# EasyEDA Pro project 2轴4.0控制板PCB源文件（LY-2X4.5-V4-ESD）.eprj, schematic 2轴4.0-
Board Name: 2轴4.0-; Create Date: 2025-01-15; Page Name: 2轴4.0-; Project Name: 2轴4.0; Schematic Name: 2轴4.0-; Update Date: 2025-01-18; Company: 嘉立创EDA; Page Size: A2; Version: V1.0
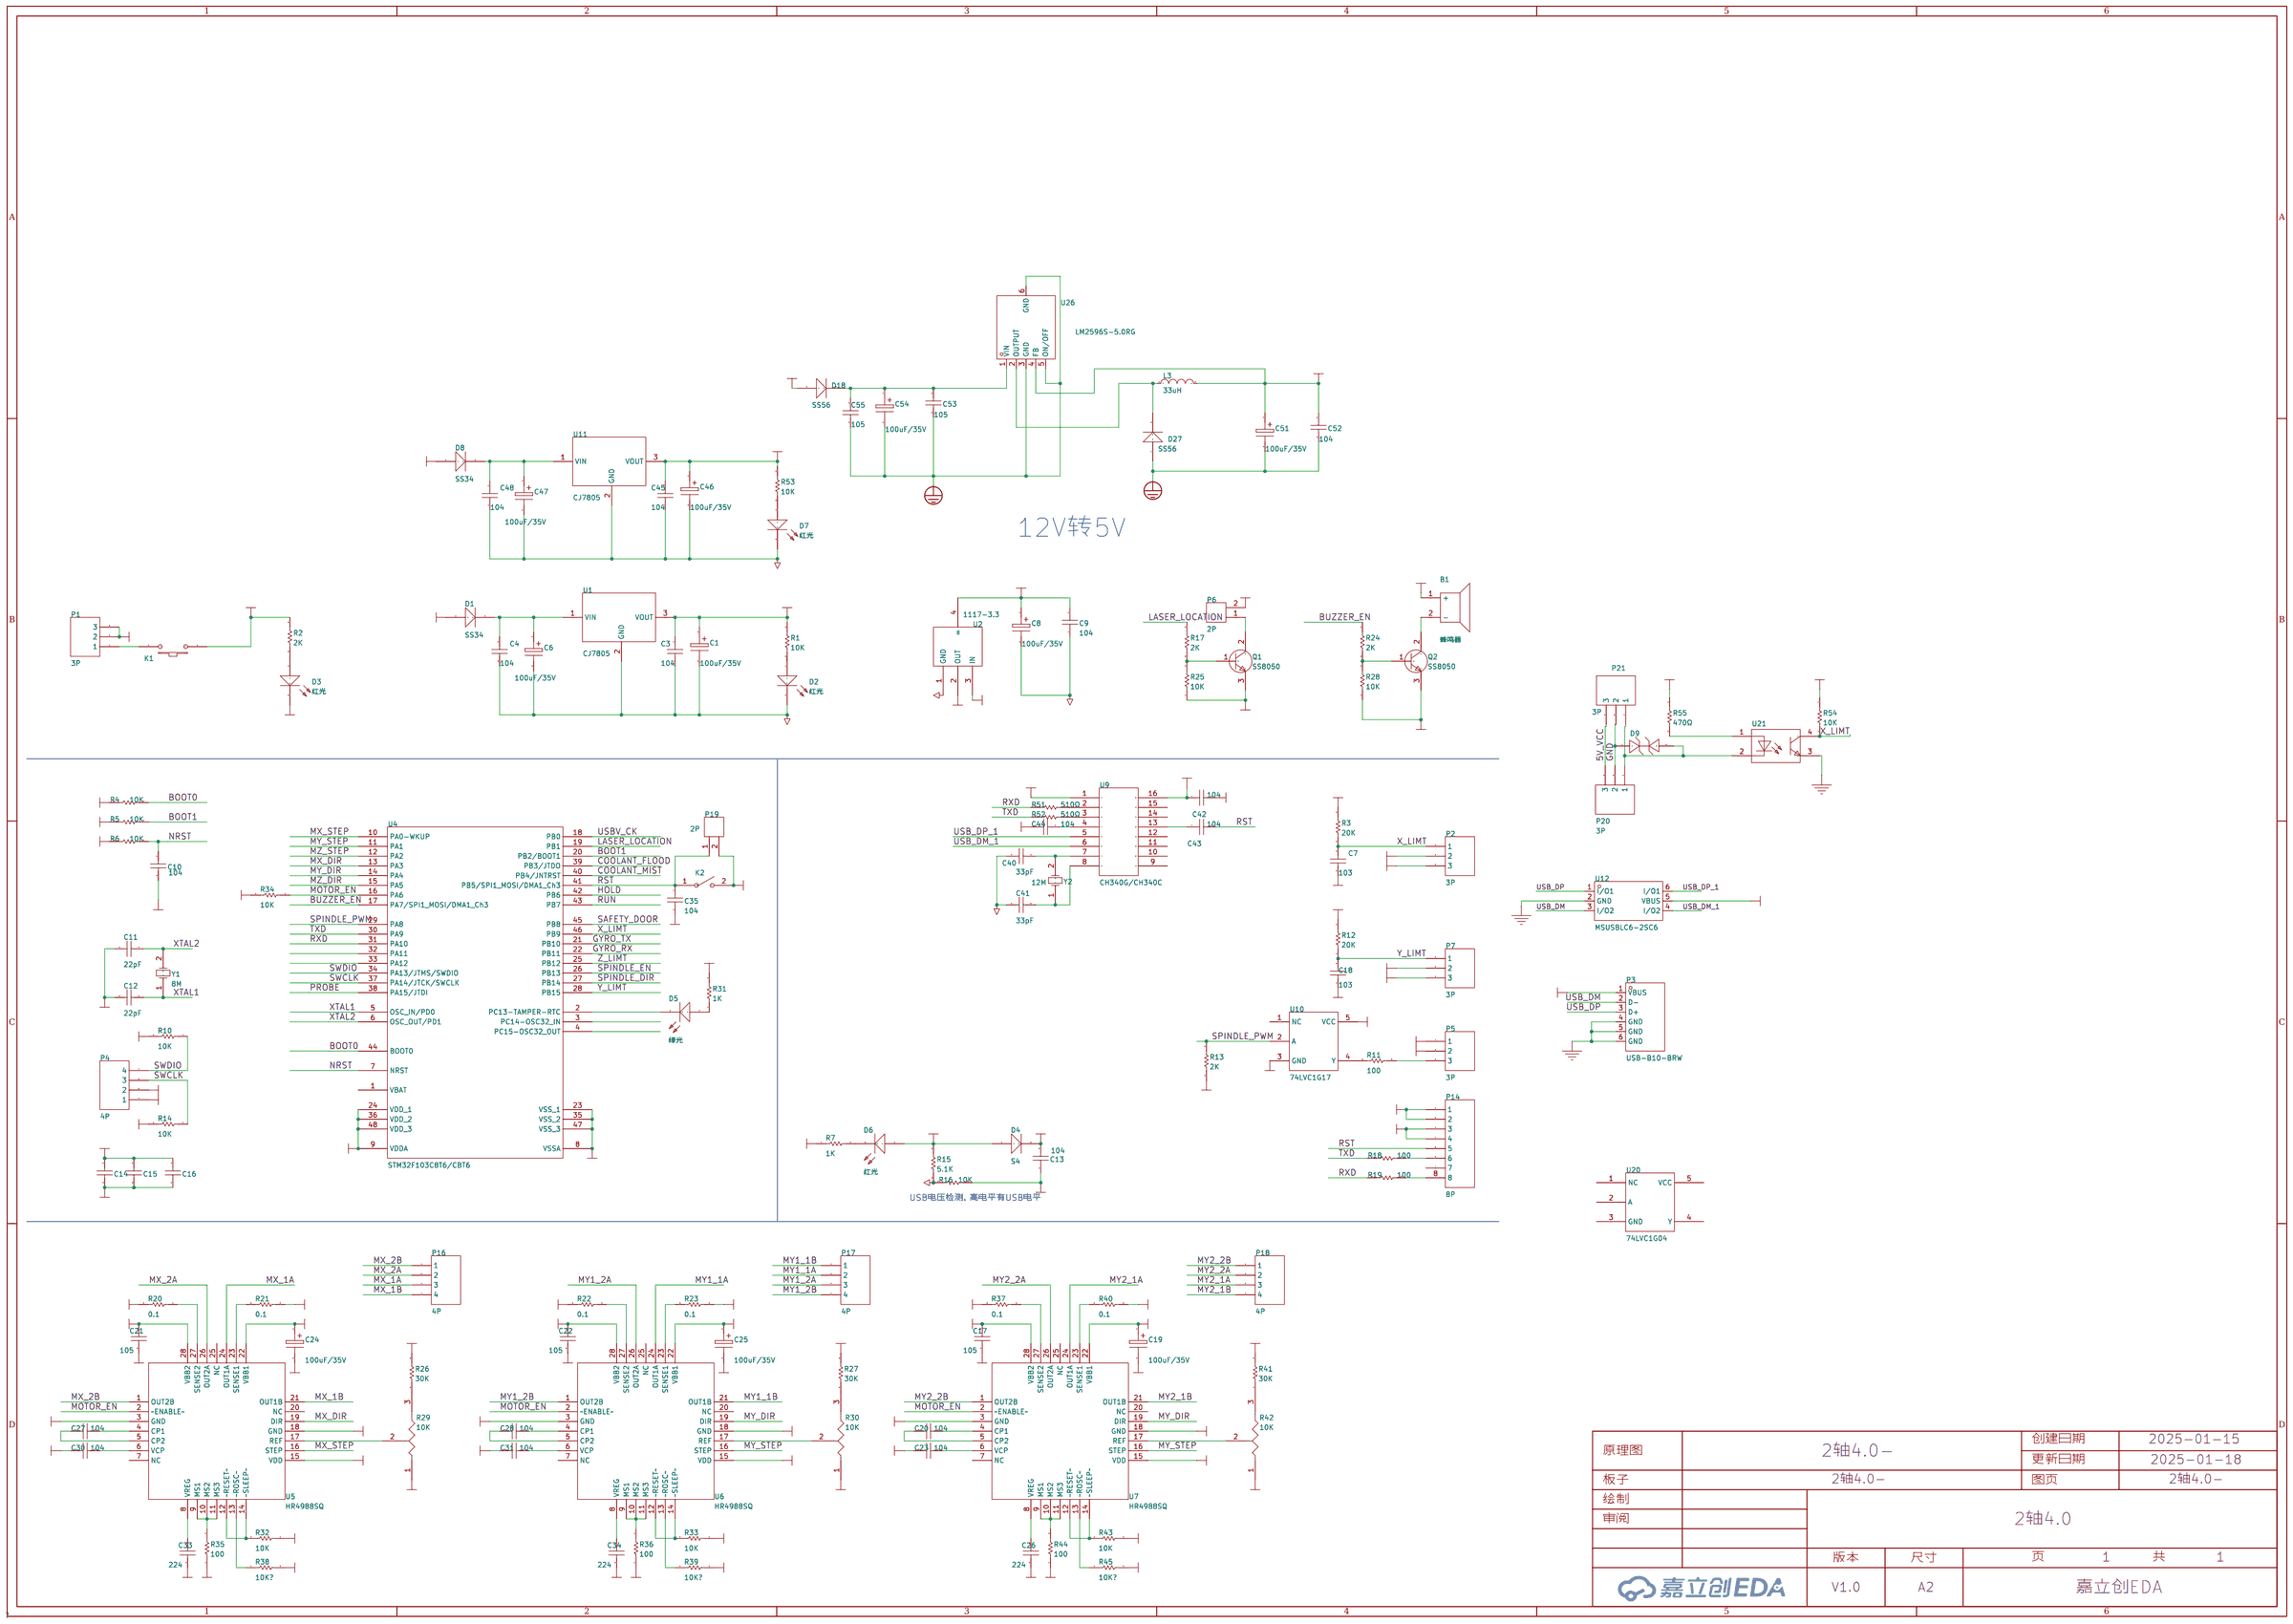
[diagram p0: schematic sheet]

## Parts
B1  蜂鸣器  [蜂鸣器9]
C1  100uF/35V  [电解电容贴片6X6]
C3  104  [0603C]
C4  104  [0603C]
C6  100uF/35V  [电解电容贴片6X6]
C7  103  [0603C]
C8  100uF/35V  [电解电容贴片6X6]
C9  104  [0603C]
C10  104  [0603C]
C11  100pF  [0603C]
C12  100pF  [0603C]
C13  104  [0603C]
C14  104  [0603C]
C15  104  [0603C]
C16  104  [0603C]
C17  105  [0805C]
C18  103  [0603C]
C19  100uF/35V  [电解电容贴片6X6]
C20  104  [0603C]
C21  105  [0805C]
C22  105  [0805C]
C23  104  [0603C]
C24  100uF/35V  [电解电容贴片6X6]
C25  100uF/35V  [电解电容贴片6X6]
C26  224  [0603C]
C27  104  [0603C]
C28  104  [0603C]
C30  104  [0603C]
C31  104  [0603C]
C33  224  [0603C]
C34  224  [0603C]
C35  104  [0603C]
C40  18pF  [0603C]
C41  18pF  [0603C]
C42  104  [0603C]
C43  104  [0603C]
C44  104  [0603C]
C45  104  [0603C]
C46  100uF/35V  [电解电容贴片6X6]
C47  100uF/35V  [电解电容贴片6X6]
C48  104  [0603C]
C51  100uF/35V  [电解电容贴片6x6]
C52  104  [C0603]
C53  105  [C0603]
C54  100uF/35V  [电解电容贴片6x6]
C55  105  [C0603]
D1  SS34  [SMA]
D2  红光  [0603LED]
D3  红光  [0603LED]
D4  S4  [SOD-123]
D5  绿光  [0603LED]
D6  红光  [0603LED]
D7  红光  [0603LED]
D8  SS34  [SMA]
D9  ESD05V52D-C  [SOD-523_L1.2-W0.8-LS1.6-BI]
D18  SS56  [SMA]
D27  SS56  [SMA]
K1  按键  [按键18X13]
K2  开关  [按键6X6贴片]
L3  33uH  [IND-SMD_L7.0-W7.0_SMDRI74-330MT]
P1  3P  [DC0044A]
P2  3P  [HDR1X3_P]
P3  USB-B10-BRW  [USB-B-TH_USB-B10-BRW]
P4  4P  [SIP4]
P5  3P  [HDR1X3_P]
P6  2P  [HDR1X2_P]
P7  3P  [HDR1X3_P]
P14  8P  [IDC8弯脚]
P16  4P  [HDR1X4_P]
P17  4P  [HDR1X4_P]
P18  4P  [HDR1X4_P]
P19  2P  [HDR1X2_P]
P20  3P  [HDR1X3_CON]
P21  3P  [HDR1X3_CON]
Q1  SS8050  [SOT-23]
Q2  SS8050  [SOT-23]
R1  10K  [0603R]
R2  2K  [0603R]
R3  10K  [0603R]
R4  10K  [0603R]
R5  10K  [0603R]
R6  10K  [0603R]
R7  1K  [0603R]
R10  10K  [0603R]
R11  100  [0603R]
R12  10K  [0603R]
R13  2K  [0603R]
R14  10K  [0603R]
R15  5.1K  [0603R]
R16  10K  [0603R]
R17  2K  [0603R]
R18  100  [0603R]
R19  100  [0603R]
R20  0.1  [0805R]
R21  0.1  [0805R]
R22  0.1  [0805R]
R23  0.1  [0805R]
R24  2K  [0603R]
R25  10K  [0603R]
R26  30K  [0603R]
R27  30K  [0603R]
R28  10K  [0603R]
R29  10K  [松下贴片电位器3X3]
R30  10K  [松下贴片电位器3X3]
R31  1K  [0603R]
R32  10K  [0603R]
R33  10K  [0603R]
R34  10K  [0603R]
R35  100  [0603R]
R36  100  [0603R]
R37  0.1  [0805R]
R38  10K?  [0603R]
R39  10K?  [0603R]
R40  0.1  [0805R]
R41  30K  [0603R]
R42  10K  [松下贴片电位器3X3]
R43  10K  [0603R]
R44  100  [0603R]
R45  10K?  [0603R]
R51  510Ω  [0603R]
R52  510Ω  [0603R]
R53  10K  [0603R]
R54  10K  [0603R]
R55  470Ω  [0603R]
U1  CJ7805  [TO-263-2]
U2  1117-3.3  [SOT-223]
U4  STM32F103C8T6/CBT6  [LQFP48]
U5  HR4988SQ  [QFN28]
U6  HR4988SQ  [QFN28]
U7  HR4988SQ  [QFN28]
U9  CH340G/CH340C  [SOP16]
U10  74LVC1G17  [SOT-23-5]
U11  CJ7805  [TO-263-2]
U12  MSUSBLC6-2SC6  [SOT-23-6_L2.9-W1.6-P0.95-LS2.8-BL]
U20  74LVC1G04  [SOT-23-5]
U21  LTV-357T-C  [SOP-4_L4.4-W3.9-P2.54-LS7.0-TL]
U26  LM2596S-5.0RG  [TO-263-5_L10.1-W8.7-P1.70-LS15.2-BR]
Y1  8M  [晶振贴片]
Y2  12M  [晶振贴片49SSMD]

## Library data of the parts
B1 = 蜂鸣器: Library Name: SCH封装库
C1 C6 C8 C19 C24 C25 C46 C47 = 100uF/35V: Origin Footprint 2: X47U; Origin Footprint 1: 电解电容贴片6x6; Design Item ID: ELECTRO1; Library Name: *
C3 C9 C10 C13 C35 C42-C45 = 104: Capacitor (Semiconductor SIM Model); Published: 8-Jun-2000; LatestRevisionDate: 17-Jul-2002; LatestRevisionNote: Re-released for DXP Platform.; PackageReference: C1206; Publisher: Altium Limited; Origin Footprint 2: C1206; Origin Footprint 3: 0402; Origin Footprint 4: 1310[0504]; Origin Footprint 5: 1608[0603]; Origin Footprint 6: C1210; Origin Footprint 7: C0805; Origin Footprint 8: C1206; Origin Footprint 9: 0805; Origin Footprint 10: 0805L; Origin Footprint 11: 0805C; Design Item ID: Cap Semi; Library Name: Miscellaneous Devices
C4 C14-C16 C20 C23 C27 C28 C30 C31 C48 = 104: Origin Footprint 2: CAP; Origin Footprint 3: 0805C; Design Item ID: CAP; Library Name: SCH封装库
C7 C18 = 103: Design Item ID: CAP; Library Name: SCH封装库
C11 C12 = 22pF: Capacitor (Semiconductor SIM Model); Published: 8-Jun-2000; LatestRevisionDate: 17-Jul-2002; LatestRevisionNote: Re-released for DXP Platform.; PackageReference: C1206; Publisher: Altium Limited; Origin Footprint 2: C1206; Origin Footprint 3: 0402; Origin Footprint 4: 1310[0504]; Origin Footprint 5: 1608[0603]; Origin Footprint 6: C1210; Origin Footprint 7: C0805; Origin Footprint 8: C1206; Origin Footprint 9: 0805; Origin Footprint 10: 0805L; Origin Footprint 11: 0805C; Design Item ID: Cap Semi; Library Name: Miscellaneous Devices
C17 C21 C22 = 105: Design Item ID: CAP; Library Name: SCH封装库
C26 C33 C34 = 224: Design Item ID: CAP; Library Name: SCH封装库
C40 C41 = 33pF: Capacitor (Semiconductor SIM Model); Published: 8-Jun-2000; LatestRevisionDate: 17-Jul-2002; LatestRevisionNote: Re-released for DXP Platform.; PackageReference: C1206; Publisher: Altium Limited; Origin Footprint 2: C1206; Origin Footprint 3: 0402; Origin Footprint 4: 1310[0504]; Origin Footprint 5: 1608[0603]; Origin Footprint 6: C1210; Origin Footprint 7: C0805; Origin Footprint 8: C1206; Origin Footprint 9: 0805; Origin Footprint 10: 0805L; Design Item ID: Cap Semi; Library Name: Miscellaneous Devices
C51 C54 = 100uF/35V: Origin Footprint 2: X47U; Origin Footprint 1: ________Ƭ6x6; Design Item ID: ELECTRO1; Library Name: *
C52 = 104: Design Item ID: CAP; Library Name: SCH--װ--
C53 C55 = 105: Design Item ID: CAP; Library Name: SCH--װ--
D1 D8 = SS34: Design Item ID: 1N4148; Library Name: SCH封装库
D2 D3 D6 D7 = 红光: Origin Footprint 2: LED(小); Design Item ID: LED; Library Name: SCH封装库
D4 = S4: Design Item ID: 1N4148; Library Name: SCH封装库
D5 = 绿光: Origin Footprint 2: LED(小); Design Item ID: LED; Library Name: SCH封装库
D9 = ESD05V52D-C: 极性：双向 反向截止电压(Vrwm)：5V 击穿电压(VBR)：5.6V 钳位电压(Vc)@Ipp：15V 反向截止电压(Vrwm)：5V 击穿电压(最小值)：5.6V 峰值脉冲电流(Ipp)@tp=8/20μs：5A 最大钳位电压：15V; Supplier Part: C727170; Manufacturer: TWGMC(台湾迪嘉); Supplier Footprint: SOD-523; JLCPCB Part Class: 扩展库; Datasheet: https://atta.szlcsc.com/upload/public/pdf/source/20200827/C727170_700AFDE065FF081A69A0C04747B3686A.pdf; Supplier: LCSC
D18 = SS56: Design Item ID: 1N4148; Library Name: SCH封装库
D27 = SS56: Design Item ID: 1N4148; Library Name: SCH--װ--
K1 = 按键: Origin Footprint 2: 按键（小）; Origin Footprint 3: 侧立按键; Origin Footprint 1: 按键18x13; Library Name: SCH封装库
K2 = 开关: Library Name: SCH封装库
L3 = SMDRI74-330MT: 电感值:33uH;精度:±20%;额定电流:960mA;饱和电流(Isat):1.8A;类型:屏蔽电感;; LCSC Part Name: 33uH±20%1.8A; Supplier Part: C49625; Manufacturer: SXN(顺翔诺); Supplier Footprint: SMD,7.5x7.5mm; JLCPCB Part Class: 扩展库; Datasheet: https://atta.szlcsc.com/upload/public/pdf/source/20210810/6F96FDC19AA308DD2AD166FFB9640E87.pdf; Supplier: LCSC; Tolerance: ±20%; Rated Current: 960mA; Saturation Current (Isat): 1.8A; DC Resistance (DCR): 170mΩ; Type: 屏蔽电感
P1 P2 P5 P7 P20 = 3P: Library Name: SCH封装库
P3 = USB-B10-BRW: 连接器类型:Type-B;标准:USB 2.0;公母:母;端口数量:1;触点数量:4P;安装方式:弯插;额定电流 - 电源:1.5A;工作温度范围:-20℃~+70℃;焊接温度(最大值):260℃;; LCSC Part Name: Type-B母弯插; Supplier Part: C720549; Manufacturer: XUNPU(讯普); Supplier Footprint: 插件; JLCPCB Part Class: 扩展库; Datasheet: https://atta.szlcsc.com/upload/public/pdf/source/20200812/C720549_53E9294752E2933874870440E626C579.pdf; Supplier: LCSC; Connector Type: Type-B; Standard: USB2.0; Gender: 母; Number of Ports: 1; Number of Contacts: 4P; Mounting Style: 弯插; Current Rating - Power (Max): 1.5A; Operating Temperature Range: -20℃~+70℃; Soldering Temperature(Max): 260℃
P4 P16-P18 = 4P: Library Name: SCH封装库
P6 P19 = 2P: Library Name: SCH封装库
P14 = 8P: Library Name: SCH封装库
P21 = 3P: Library Name: SCH--װ--
Q1 Q2 = SS8050: Published: 8-Jun-2000; LatestRevisionDate: 17-Jul-2002; LatestRevisionNote: Re-released for DXP Platform.; PackageReference: TO-226; Publisher: Altium Limited; Code_JEDEC: TO-226-AA; Origin Footprint 2: TO-92; Design Item ID: NPN; Library Name: SCH封装库
R1 R7 R31 R53 = 1K: Resistor; Published: 8-Jun-2000; LatestRevisionDate: 17-Jul-2002; LatestRevisionNote: Re-released for DXP Platform.; PackageReference: AXIAL-0.3; Publisher: Altium Limited; Origin Footprint 2: AXIAL-0.3; Origin Footprint 3: R0805; Origin Footprint 4: 0805R; Design Item ID: RES; Library Name: SCH封装库
R2 R13 R17 R24 = 2K: Resistor; Published: 8-Jun-2000; LatestRevisionDate: 17-Jul-2002; LatestRevisionNote: Re-released for DXP Platform.; PackageReference: AXIAL-0.3; Publisher: Altium Limited; Origin Footprint 2: AXIAL-0.3; Origin Footprint 3: R0805; Origin Footprint 4: 0805R; Design Item ID: RES; Library Name: SCH封装库
R3 R12 R16 R25 R28 R32-R34 R43 R54 = 10K: Resistor; Published: 8-Jun-2000; LatestRevisionDate: 17-Jul-2002; LatestRevisionNote: Re-released for DXP Platform.; PackageReference: AXIAL-0.3; Publisher: Altium Limited; Origin Footprint 2: AXIAL-0.3; Origin Footprint 3: R0805; Origin Footprint 4: 0805R; Design Item ID: RES; Library Name: SCH封装库
R4-R6 R10 R14 = 10K: Resistor; Published: 8-Jun-2000; LatestRevisionDate: 17-Jul-2002; LatestRevisionNote: Re-released for DXP Platform.; PackageReference: AXIAL-0.3; Publisher: Altium Limited; Origin Footprint 2: AXIAL-0.3; Origin Footprint 3: 0805R; Origin Footprint 4: 0805R; Design Item ID: RES; Library Name: SCH封装库
R11 R18 R19 R35 R36 R44 R51 R52 = 100: Resistor; Published: 8-Jun-2000; LatestRevisionDate: 17-Jul-2002; LatestRevisionNote: Re-released for DXP Platform.; PackageReference: AXIAL-0.3; Publisher: Altium Limited; Origin Footprint 2: AXIAL-0.3; Origin Footprint 3: R0805; Origin Footprint 4: 0805R; Design Item ID: RES; Library Name: SCH封装库
R15 = 5.1K: Resistor; Published: 8-Jun-2000; LatestRevisionDate: 17-Jul-2002; LatestRevisionNote: Re-released for DXP Platform.; PackageReference: AXIAL-0.3; Publisher: Altium Limited; Origin Footprint 2: AXIAL-0.3; Origin Footprint 3: R0805; Origin Footprint 4: 0805R; Design Item ID: RES; Library Name: SCH封装库
R20-R23 R37 R40 = 0.1: Resistor; Published: 8-Jun-2000; LatestRevisionDate: 17-Jul-2002; LatestRevisionNote: Re-released for DXP Platform.; PackageReference: AXIAL-0.3; Publisher: Altium Limited; Origin Footprint 2: AXIAL-0.3; Origin Footprint 3: R0805; Origin Footprint 4: 0603R; Design Item ID: RES; Library Name: SCH封装库
R26 R27 R41 = 30K: Resistor; Published: 8-Jun-2000; LatestRevisionDate: 17-Jul-2002; LatestRevisionNote: Re-released for DXP Platform.; PackageReference: AXIAL-0.3; Publisher: Altium Limited; Origin Footprint 2: AXIAL-0.3; Origin Footprint 3: R0805; Origin Footprint 4: 0805R; Design Item ID: RES; Library Name: SCH封装库
R29 R30 R42 = 10K: Design Item ID: 电位器; Library Name: SCH封装库
R38 R39 R45 = 10K?: Resistor; Published: 8-Jun-2000; LatestRevisionDate: 17-Jul-2002; LatestRevisionNote: Re-released for DXP Platform.; PackageReference: AXIAL-0.3; Publisher: Altium Limited; Origin Footprint 2: AXIAL-0.3; Origin Footprint 3: R0805; Design Item ID: RES; Library Name: SCH封装库
R55 = 470Ω: Resistor; Published: 8-Jun-2000; LatestRevisionDate: 17-Jul-2002; LatestRevisionNote: Re-released for DXP Platform.; PackageReference: AXIAL-0.3; Publisher: Altium Limited; Origin Footprint 2: AXIAL-0.3; Origin Footprint 3: R0805; Origin Footprint 4: 0805R; Design Item ID: RES; Library Name: SCH封装库
U1 U11 = CJ7805: Design Item ID: 7805; Library Name: SCH封装库
U2 = 1117-3.3: Design Item ID: LM1117; Library Name: Party600
U4 = STM32F103C8T6/CBT6: STM32 ARM-based 32-bit MCU with 32 Kbytes Flash, 48-pin LQFP, Industrial Temperature; Published: *; DatasheetVersion: *; PackageVersion: *; PackageReference: *; Publisher: *; PackageDescription: *; ComponentLink1Description: *; ComponentLink1URL: *; ComponentLink2Description: *; ComponentLink2URL: *; Origin Footprint 2: LQFP48_L; Origin Footprint 3: LQFP48_M; Design Item ID: STM32F103C6T6; Library Name: ST Microcontroller 32-Bit STM32 SCH
U5-U7 = HR4988SQ: Design Item ID: HR4988; Library Name: SCH封装库
U9 = CH340G: Design Item ID: DIP16; Library Name: SCH封装库
U10 = 74LVC1G17: Library Name: SCH封装库
U12 = MSUSBLC6-2SC6: 反向截止电压(Vrwm):5V;最大钳位电压:15V;峰值脉冲电流(Ipp)@10/1000us:6A;峰值脉冲功率(Ppp)@10/1000us:150W;击穿电压:9V;; LCSC Part Name: UL26; Supplier Part: C2830148; Manufacturer: MSKSEMI(美森科); Supplier Footprint: SOT-23-6; JLCPCB Part Class: 扩展库; Datasheet: https://atta.szlcsc.com/upload/public/pdf/source/20210623/C2830148_830D5495FDC11AF9D5769967D4D0CCFD.pdf; Supplier: LCSC; Reverse Stand-Off Voltage (Vrwm): 5V; Maximum Clamping Voltage: 15V; Peak Pulse Current (Ipp)@10/1000us: 6A; Peak Pulse Power Dissipation (Ppp)@10/1000us: 150W; Breakdown Voltage: 9V; Type: ESD
U20 = 74LVC1G04: Design Item ID: 74LVC1G17; Library Name: SCH--װ--
U21 = LTV-357T-C: 输入电压类型:DC;正向电压:1.2V;输出电流:50mA;隔离电压(rms):3.75kV;反向电压:6V;接收端电压:35V;输出通道数:1;集射极饱和电压(Vce(sat)@Ic,IF):200mV@1mA,20mA;; Supplier: LCSC; Manufacturer: LITEON(光宝); Supplier Part: C119091; JLCPCB Part Class: 扩展库; LCSC Part Name: DC输入隔离电压(rms):3750V; Supplier Footprint: SOP-4-2.54mm; Datasheet: https://atta.szlcsc.com/upload/public/pdf/source/20170930/C133128_1506736380934997376.pdf; Input voltage type: DC; Output Type: 光电三极管; Forward Voltage: 1.2V; Output Current: 50mA; Isolation Voltage(rms): 3.75kV; Reverse Voltage: 6V; Receiving End Voltage: 35V; Number of Outputs: 1; Collector-Emitter Saturation Voltage (Vce(sat)@Ic,IF): 200mV@1mA,20mA; Rise time: 4us@2mA,100Ω; Fall time: 3us@2mA,100Ω; Operating Temperature: -55℃~+110℃
U26 = LM2596S-5.0RG_C5157156: Supplier Part: C5157156; Manufacturer: HGC(深圳汉芯); Supplier Footprint: TO-263-5; JLCPCB Part Class: 扩展库; Datasheet: https://atta.szlcsc.com/upload/public/pdf/source/20220308/5E7E021717B07C63974FB4CE30FAB155.pdf; Supplier: LCSC
Y1 = 8M: Crystal Oscillator; Published: 8-Jun-2000; LatestRevisionDate: 17-Jul-2002; LatestRevisionNote: Re-released for DXP Platform.; PackageReference: R38; Publisher: Altium Limited; Origin Footprint 2: R38; Origin Footprint 3: XTAL-49S; Design Item ID: XTAL; Library Name: Miscellaneous Devices
Y2 = 12M: Crystal Oscillator; Published: 8-Jun-2000; LatestRevisionDate: 17-Jul-2002; LatestRevisionNote: Re-released for DXP Platform.; PackageReference: R38; Publisher: Altium Limited; Origin Footprint 2: R38; Origin Footprint 3: XTAL-49S; Design Item ID: XTAL; Library Name: Miscellaneous Devices

## Nets
3V3: C8.1 C9.2 C14.2 C15.2 C16.2 P4.2 R6.1 R10.2 R14.2 R31.2 R34.2 R54.1 U2.2(OUT) U2.4(=) U4.9(VDDA) U4.24(VDD_1) U4.36(VDD_2) U4.48(VDD_3)
5V_MCU: C1.1 C3.2 R1.1 U1.3(VOUT)
5V_VCC: P20.3 P21.3 R55.1
12V: C17.1 C19.1 C21.1 C22.1 C23.2 C24.1 C25.1 C30.2 C31.2 D1.1 D8.1 D18.1 K1.1 P5.1 R2.1 U5.22(VBB1) U5.28(VBB2) U6.22(VBB1) U6.28(VBB2) U7.22(VBB1) U7.28(VBB2)
GND: C1.2 C3.1 C4.1 C6.2 C7.1 C8.2 C9.1 C10.1 C11.2 C12.2 C13.1 C14.1 C15.1 C16.1 C17.2 C18.1 C19.2 C21.2 C22.2 C24.2 C25.2 C26.2 C33.2 C34.2 C35.2 C40.2 C41.2 C42.2 C44.2 C45.1 C46.2 C47.2 C48.1 D2.2 D3.2 D7.2 D9.1 K2.2(NO) P1.2 P1.3 P2.2 P3.4(GND) P3.5(GND) P3.6(GND) P4.1 P5.2 P7.2 P14.3 P14.4 P19.2 P20.2 P21.2 Q1.3(E) Q2.3(E) R4.1 R5.1 R7.1 R13.1 R16.1 R20.2 R21.1 R22.2 R23.1 R25.1 R28.1 R29.1(A) R30.1(A) R37.2 R38.2 R39.2 R40.1 R42.1(A) R45.2 U1.2(GND) U2.1(GND) U4.8(VSSA) U4.23(VSS_1) U4.35(VSS_2) U4.47(VSS_3) U5.3(GND) U5.18(GND) U6.3(GND) U6.18(GND) U7.3(GND) U7.18(GND) U9.1 U10.3(GND) U11.2(GND) U12.2(GND) U21.3
PGND: C51.2 C52.1 C53.1 C54.2 C55.2 D27.1 U26.3(GND) U26.5(ON/OFF) U26.6(GND)
VCC: B1.1(+) C13.2 C45.2 C46.1 C51.1 C52.2 D4.2 L3.2 P2.3 P6.2 P7.3 P14.1 P14.2 R3.2 R12.2 R26.2 R27.2 R32.1 R33.1 R35.1 R36.1 R41.2 R43.1 R44.1 R53.1 U2.3(IN) U5.15(VDD) U6.15(VDD) U7.15(VDD) U10.5(VCC) U11.3(VOUT) U26.4(FB)
BOOT0: R4.2 U4.44(BOOT0)
BOOT1: R5.2 U4.20(PB2/BOOT1)
BUZZER_EN: R24.1 U4.17(PA7/SPI1_MOSI/DMA1_Ch3)
COOLANT_FLOOD: U4.39(PB3/JTDO)
COOLANT_MIST: U4.40(PB4/JNTRST)
GYRO_RX: U4.22(PB11)
GYRO_TX: U4.21(PB10)
HOLD: U4.42(PB6)
LASER_LOCATION: R17.1 U4.19(PB1)
MOTOR_EN: R34.1 U4.16(PA6) U5.2(~ENABLE~) U6.2(~ENABLE~) U7.2(~ENABLE~)
MX_1A: P16.3 U5.24(OUT1A)
MX_1B: P16.4 U5.21(OUT1B)
MX_2A: P16.2 U5.26(OUT2A)
MX_2B: P16.1 U5.1(OUT2B)
MX_DIR: U4.13(PA3) U5.19(DIR)
MX_STEP: U4.10(PA0-WKUP) U5.16(STEP)
MY1_1A: P17.2 U6.24(OUT1A)
MY1_1B: P17.1 U6.21(OUT1B)
MY1_2A: P17.3 U6.26(OUT2A)
MY1_2B: P17.4 U6.1(OUT2B)
MY2_1A: P18.3 U7.24(OUT1A)
MY2_1B: P18.4 U7.21(OUT1B)
MY2_2A: P18.2 U7.26(OUT2A)
MY2_2B: P18.1 U7.1(OUT2B)
MY_DIR: U4.14(PA4) U6.19(DIR) U7.19(DIR)
MY_STEP: U4.11(PA1) U6.16(STEP) U7.16(STEP)
MZ_DIR: U4.15(PA5)
MZ_STEP: U4.12(PA2)
NRST: C10.2 R6.2 U4.7(NRST)
PROBE: U4.38(PA15/JTDI)
RST: C35.1 C43.2 K2.1(COMMON) P14.5 P19.1 U4.41(PB5/SPI1_MOSI/DMA1_Ch3)
RUN: U4.43(PB7)
RXD: R19.1 R51.2 U4.31(PA10)
SAFETY_DOOR: U4.45(PB8)
SPINDLE_DIR: U4.27(PB14)
SPINDLE_EN: U4.26(PB13)
SPINDLE_PWM: R13.2 U4.29(PA8) U10.2(A)
SWCLK: P4.3 R14.1 U4.37(PA14/JTCK/SWCLK)
SWDIO: P4.4 R10.1 U4.34(PA13/JTMS/SWDIO)
TXD: R18.1 R52.2 U4.30(PA9)
USB_DM: P3.2(D-) U12.3(I/O2)
USB_DM_1: U9.6 U12.4(I/O2)
USB_DP: P3.3(D+) U12.1(I/O1)
USB_DP_1: U9.5 U12.6(I/O1)
USBV_CK: R15.1 R16.2 U4.18(PB0)
VUSB: C42.1 D4.1 D6.1 P3.1(VBUS) R15.2 U9.16 U12.5(VBUS)
X_LIMT: C7.2 P2.1 R3.1 R54.2 U4.46(PB9) U21.4
XTAL1: C12.1 U4.5(OSC_IN/PD0) Y1.1(OSC1)
XTAL2: C11.1 U4.6(OSC_OUT/PD1) Y1.2(OSC2)
Y_LIMT: C18.2 P7.1 R12.1 U4.28(PB15)
Z_LIMT: U4.25(PB12)
Net-(C47-1): C47.1 C48.2 D8.2 U11.1(VIN)
Net-(C53-2): C53.2 C54.1 C55.1 D18.2 U26.1(VIN)
Net-(D7-1): D7.1 R53.2
Net-(D9-2): D9.2 P20.1 P21.1 U21.2
Net-(D27-2): D27.2 L3.1 U26.2(OUTPUT)
Net-(R55-2): R55.2 U21.1
NETB1_2: B1.2(-) Q2.2(C)
NETC4_2: C4.2 C6.1 D1.2 U1.1(VIN)
NETC20_1: C20.1 U7.4(CP1)
NETC20_2: C20.2 U7.5(CP2)
NETC23_1: C23.1 U7.6(VCP)
NETC26_1: C26.1 U7.8(VREG)
NETC27_1: C27.1 U5.4(CP1)
NETC27_2: C27.2 U5.5(CP2)
NETC28_1: C28.1 U6.4(CP1)
NETC28_2: C28.2 U6.5(CP2)
NETC30_1: C30.1 U5.6(VCP)
NETC31_1: C31.1 U6.6(VCP)
NETC33_1: C33.1 U5.8(VREG)
NETC34_1: C34.1 U6.8(VREG)
NETC40_1: C40.1 U9.7 Y2.2(OSC2)
NETC41_1: C41.1 U9.8 Y2.1(OSC1)
NETC43_1: C43.1 U9.13
NETC44_1: C44.1 U9.4
NETD2_1: D2.1 R1.2
NETD3_1: D3.1 R2.2
NETD5_1: D5.1 R31.1
NETD5_2: D5.2 U4.2(PC13-TAMPER-RTC)
NETD6_2: D6.2 R7.2
NETK1_2: K1.2 P1.1
NETP5_3: P5.3 R11.2
NETP6_1: P6.1 Q1.2(C)
NETP14_6: P14.6 R18.2
NETP14_8: P14.8 R19.2
NETQ1_1: Q1.1(B) R17.2 R25.2
NETQ2_1: Q2.1(B) R24.2 R28.2
NETR11_1: R11.1 U10.4(Y)
NETR20_1: R20.1 U5.27(SENSE2)
NETR21_2: R21.2 U5.23(SENSE1)
NETR22_1: R22.1 U6.27(SENSE2)
NETR23_2: R23.2 U6.23(SENSE1)
NETR26_1: R26.1 R29.3(B)
NETR27_1: R27.1 R30.3(B)
NETR29_2: R29.2(TAP) U5.17(REF)
NETR30_2: R30.2(TAP) U6.17(REF)
NETR32_2: R32.2 U5.12(~RESET~) U5.14(~SLEEP~)
NETR33_2: R33.2 U6.12(~RESET~) U6.14(~SLEEP~)
NETR35_2: R35.2 U5.9(MS1) U5.10(MS2) U5.11(MS3)
NETR36_2: R36.2 U6.9(MS1) U6.10(MS2) U6.11(MS3)
NETR37_1: R37.1 U7.27(SENSE2)
NETR38_1: R38.1 U5.13(~ROSC~)
NETR39_1: R39.1 U6.13(~ROSC~)
NETR40_2: R40.2 U7.23(SENSE1)
NETR41_1: R41.1 R42.3(B)
NETR42_2: R42.2(TAP) U7.17(REF)
NETR43_2: R43.2 U7.12(~RESET~) U7.14(~SLEEP~)
NETR44_2: R44.2 U7.9(MS1) U7.10(MS2) U7.11(MS3)
NETR45_1: R45.1 U7.13(~ROSC~)
NETR51_1: R51.1 U9.2
NETR52_1: R52.1 U9.3

Not connected (* = marked no-connect by the designer): P14 7; U4 1(VBAT) 3(PC14-OSC32_IN) 4(PC15-OSC32_OUT) 32(PA11) 33(PA12); U5 7(NC) 20(NC) 25(NC); U6 7(NC) 20(NC) 25(NC); U7 7(NC) 20(NC) 25(NC); U9 9 10 11 12 14 15; U10 1(NC); U20 1(NC) 2(A) 3(GND) 4(Y) 5(VCC)

## Notes on the sheet
- 12V转5V
- USB电压检测，高电平有USB电平
